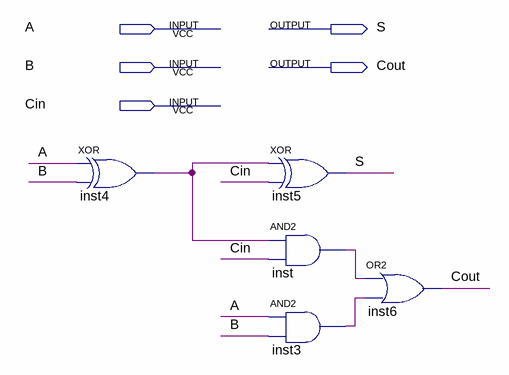
[diagram p0: schematic sheet]
// Quartus schematic FA.bdf as structural Verilog: 5 symbols, 5 pins
module FA (
  input  A,
  input  B,
  input  Cin,
  output S,
  output Cout
);

  wire inst3_out, inst4_out, inst_out;

  xor inst4 (inst4_out, A, B);
  xor inst5 (S, inst4_out, Cin);
  and inst (inst_out, inst4_out, Cin);
  and inst3 (inst3_out, A, B);
  or inst6 (Cout, inst_out, inst3_out);
endmodule
